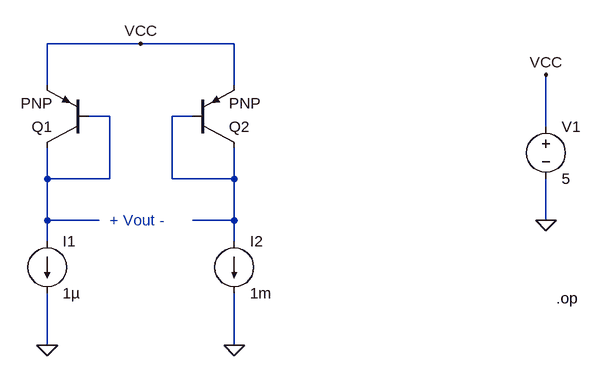
[diagram p0: schematic Tempsensor_LTspice.asc]
Tempsensor_LTspice.asc, the LTspice schematic file:
Version 4
SHEET 1 904 680
WIRE 224 -16 80 -16
WIRE 368 -16 224 -16
WIRE 80 48 80 -16
WIRE 368 48 368 -16
WIRE 176 96 144 96
WIRE 304 96 272 96
WIRE 848 112 848 32
WIRE 80 192 80 144
WIRE 176 192 176 96
WIRE 176 192 80 192
WIRE 272 192 272 96
WIRE 368 192 368 144
WIRE 368 192 272 192
WIRE 80 256 80 192
WIRE 160 256 80 256
WIRE 368 256 368 192
WIRE 368 256 304 256
WIRE 848 256 848 192
WIRE 80 288 80 256
WIRE 368 288 368 256
WIRE 80 448 80 368
WIRE 368 448 368 368
FLAG 80 448 0
FLAG 368 448 0
FLAG 224 -16 VCC
FLAG 848 256 0
FLAG 848 32 VCC
SYMBOL pnp 144 144 R180
SYMATTR InstName Q1
SYMBOL pnp 304 144 M180
SYMATTR InstName Q2
SYMBOL current 80 288 R0
SYMATTR InstName I1
SYMATTR Value 1µ
SYMBOL current 368 288 R0
SYMATTR InstName I2
SYMATTR Value 1m
SYMBOL voltage 848 96 R0
SYMATTR InstName V1
SYMATTR Value 5
TEXT 176 256 Left 2 ;+ Vout -
TEXT 864 376 Left 2 !.op

The netlist it stands for:
* Tempsensor_LTspice.asc
Q1 N001 N001 VCC 0 PNP
Q2 N002 N002 VCC 0 PNP
I1 N001 0 1µ
I2 N002 0 1m
V1 VCC 0 5
.model NPN NPN
.model PNP PNP
.lib standard.bjt
* + Vout -
.op
.backanno
.end